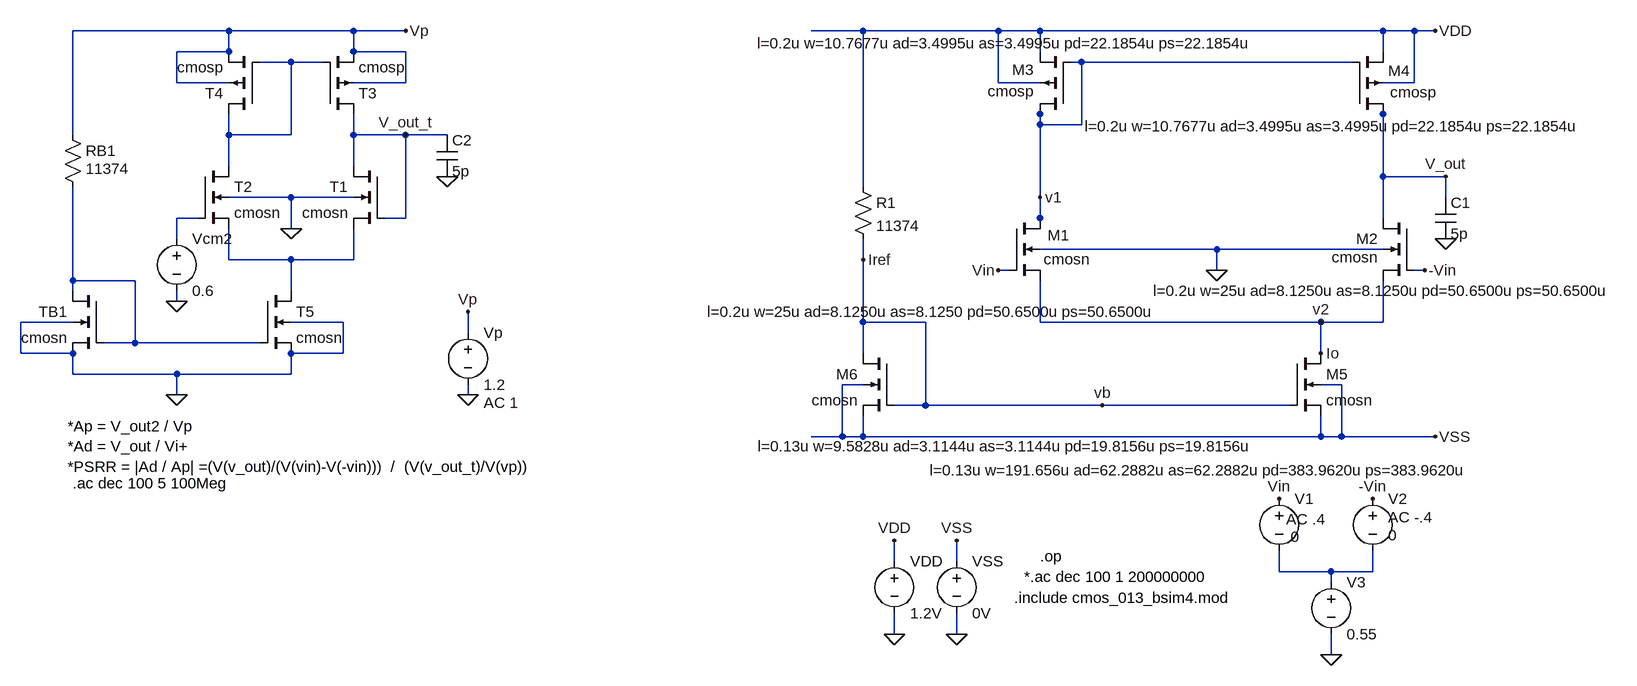
[diagram p0: schematic final_differential_pair.asc]
final_differential_pair.asc, the LTspice schematic file:
Version 4
SHEET 1 1616 948
WIRE -1072 -80 -1312 -80
WIRE -880 -80 -1072 -80
WIRE -800 -80 -880 -80
WIRE -96 -80 -176 -80
WIRE 112 -80 -96 -80
WIRE 176 -80 112 -80
WIRE 704 -80 176 -80
WIRE 752 -80 704 -80
WIRE 784 -80 752 -80
WIRE -1072 -48 -1072 -80
WIRE -1072 -48 -1152 -48
WIRE -880 -48 -880 -80
WIRE -800 -48 -880 -48
WIRE 176 -48 176 -80
WIRE 704 -48 704 -80
WIRE -976 -32 -1024 -32
WIRE -928 -32 -976 -32
WIRE 240 -32 224 -32
WIRE 656 -32 240 -32
WIRE -1152 0 -1152 -48
WIRE -1072 0 -1152 0
WIRE -800 0 -800 -48
WIRE -800 0 -880 0
WIRE 112 0 112 -80
WIRE 176 0 112 0
WIRE 752 0 752 -80
WIRE 752 0 704 0
WIRE 176 48 176 32
WIRE 704 48 704 32
WIRE 176 64 176 48
WIRE 240 64 240 -32
WIRE 240 64 176 64
WIRE -1312 80 -1312 -80
WIRE -1072 80 -1072 48
WIRE -976 80 -976 -32
WIRE -976 80 -1072 80
WIRE -880 80 -880 48
WIRE -800 80 -880 80
WIRE -736 80 -800 80
WIRE -1072 128 -1072 80
WIRE -880 128 -880 80
WIRE 704 144 704 48
WIRE 800 144 704 144
WIRE -96 160 -96 -80
WIRE -976 176 -1072 176
WIRE -880 176 -976 176
WIRE 176 176 176 64
WIRE 800 176 800 144
WIRE -1120 208 -1152 208
WIRE -800 208 -800 80
WIRE -800 208 -832 208
WIRE 176 208 176 176
WIRE 704 208 704 144
WIRE -976 224 -976 176
WIRE 176 224 176 208
WIRE -1152 240 -1152 208
WIRE 448 256 176 256
WIRE 704 256 448 256
WIRE -1072 272 -1072 224
WIRE -976 272 -1072 272
WIRE -880 272 -880 224
WIRE -880 272 -976 272
WIRE -96 272 -96 240
WIRE 128 288 112 288
WIRE 448 288 448 256
WIRE 768 288 752 288
WIRE -1312 304 -1312 160
WIRE -1216 304 -1312 304
WIRE -1312 320 -1312 304
WIRE -976 320 -976 272
WIRE -1152 336 -1152 320
WIRE -1312 368 -1392 368
WIRE -896 368 -976 368
WIRE -96 368 -96 272
WIRE 0 368 -96 368
WIRE 176 368 176 304
WIRE 608 368 176 368
WIRE 704 368 704 304
WIRE 704 368 608 368
WIRE -704 384 -704 352
WIRE -1216 400 -1216 304
WIRE -1216 400 -1264 400
WIRE -1024 400 -1216 400
WIRE -1392 416 -1392 368
WIRE -1312 416 -1392 416
WIRE -896 416 -896 368
WIRE -896 416 -976 416
WIRE -96 416 -96 368
WIRE 608 416 608 368
WIRE -1312 448 -1312 416
WIRE -1152 448 -1312 448
WIRE -976 448 -976 416
WIRE -976 448 -1152 448
WIRE -96 464 -128 464
WIRE 640 464 608 464
WIRE -1152 480 -1152 448
WIRE -704 480 -704 464
WIRE 0 496 0 368
WIRE 0 496 -48 496
WIRE 272 496 0 496
WIRE 560 496 272 496
WIRE -128 544 -128 464
WIRE -128 544 -176 544
WIRE -96 544 -96 512
WIRE -96 544 -128 544
WIRE 608 544 608 512
WIRE 608 544 -96 544
WIRE 640 544 640 464
WIRE 640 544 608 544
WIRE 784 544 640 544
WIRE -48 736 -48 704
WIRE 48 736 48 704
WIRE 544 752 544 720
WIRE 624 752 544 752
WIRE 688 752 688 720
WIRE 688 752 624 752
WIRE 624 768 624 752
WIRE -48 848 -48 816
WIRE 48 848 48 816
WIRE 624 880 624 848
FLAG 784 -80 VDD
FLAG -48 848 0
FLAG -48 704 VDD
FLAG 800 144 V_out
FLAG 784 544 VSS
FLAG 48 848 0
FLAG 48 704 VSS
FLAG 768 288 -Vin
FLAG 112 288 Vin
FLAG 544 640 Vin
FLAG 688 640 -Vin
FLAG 176 176 v1
FLAG 608 368 v2
FLAG 800 240 0
FLAG 272 496 vb
FLAG -96 272 Iref
FLAG 608 416 Io
FLAG 624 880 0
FLAG 448 288 0
FLAG -800 -80 Vp
FLAG -1152 480 0
FLAG -976 224 0
FLAG -800 80 V_out_t
FLAG -704 480 0
FLAG -1152 336 0
FLAG -736 144 0
FLAG -704 352 Vp
SYMBOL nmos4 752 208 M0
WINDOW 3 56 60 Left 2
WINDOW 123 -311 112 Left 2
SYMATTR Value cmosn
SYMATTR Value2 l=0.2u w=25u ad=8.1250u as=8.1250u pd=50.6500u ps=50.6500u
SYMATTR InstName M2
SYMBOL nmos4 128 208 R0
WINDOW 0 60 26 Left 2
WINDOW 3 54 63 Left 2
WINDOW 123 -464 144 Left 2
SYMATTR InstName M1
SYMATTR Value cmosn
SYMATTR Value2 l=0.2u w=25u ad=8.1250u as=8.1250 pd=50.6500u ps=50.6500u
SYMBOL pmos4 656 48 M180
WINDOW 123 -411 -19 Left 2
WINDOW 0 56 67 Left 2
WINDOW 3 59 34 Left 2
SYMATTR Value2 l=0.2u w=10.7677u ad=3.4995u as=3.4995u pd=22.1854u ps=22.1854u
SYMATTR InstName M4
SYMATTR Value cmosp
SYMBOL pmos4 224 48 R180
WINDOW 123 -290 109 Left 2
WINDOW 0 57 68 Left 2
WINDOW 3 57 35 Left 2
SYMATTR Value2 l=0.2u w=10.7677u ad=3.4995u as=3.4995u pd=22.1854u ps=22.1854u
SYMATTR InstName M3
SYMATTR Value cmosp
SYMBOL voltage -48 720 R0
SYMATTR InstName VDD
SYMATTR Value 1.2V
SYMBOL voltage 48 720 R0
SYMATTR InstName VSS
SYMATTR Value 0V
SYMBOL voltage 544 624 R0
WINDOW 123 11 47 Left 2
WINDOW 39 0 0 Left 0
WINDOW 3 18 74 Left 2
SYMATTR Value2 AC .4
SYMATTR Value 0
SYMATTR InstName V1
SYMBOL voltage 688 624 R0
WINDOW 123 24 44 Left 2
WINDOW 39 0 0 Left 0
WINDOW 3 24 72 Left 2
SYMATTR Value2 AC -.4
SYMATTR Value 0
SYMATTR InstName V2
SYMBOL cap 784 176 R0
SYMATTR InstName C1
SYMATTR Value 5p
SYMBOL nmos4 560 416 R0
WINDOW 123 -554 180 Left 2
SYMATTR Value2 l=0.13u w=191.656u ad=62.2882u as=62.2882u pd=383.9620u ps=383.9620u
SYMATTR InstName M5
SYMATTR Value cmosn
SYMBOL nmos4 -48 416 M0
WINDOW 123 -563 143 Left 2
SYMATTR Value2 l=0.13u w=9.5828u ad=3.1144u as=3.1144u pd=19.8156u ps=19.8156u
SYMATTR InstName M6
SYMATTR Value cmosn
SYMBOL res -112 144 R0
SYMATTR InstName R1
SYMATTR Value 11374
SYMBOL voltage 624 752 R0
SYMATTR InstName V3
SYMATTR Value 0.55
SYMBOL nmos4 -832 128 M0
SYMATTR InstName T1
SYMATTR Value cmosn
SYMATTR Value2 l=0.2u w=25u ad=8.1250u as=8.1250 pd=50.6500u ps=50.6500u
SYMBOL nmos4 -1120 128 R0
SYMATTR InstName T2
SYMATTR Value cmosn
SYMATTR Value2 l=0.2u w=25u ad=8.1250u as=8.1250 pd=50.6500u ps=50.6500u
SYMBOL pmos4 -928 48 M180
SYMATTR InstName T3
SYMATTR Value cmosp
SYMATTR Value2 l=0.2u w=10.7677u ad=3.4995u as=3.4995u pd=22.1854u ps=22.1854u
SYMBOL pmos4 -1024 48 R180
SYMATTR InstName T4
SYMATTR Value cmosp
SYMATTR Value2 l=0.2u w=10.7677u ad=3.4995u as=3.4995u pd=22.1854u ps=22.1854u
SYMBOL nmos4 -1024 320 R0
SYMATTR InstName T5
SYMATTR Value cmosn
SYMATTR Value2 l=0.13u w=191.656u ad=62.2882u as=62.2882u pd=383.9620u ps=383.9620u
SYMBOL nmos4 -1264 320 M0
SYMATTR InstName TB1
SYMATTR Value cmosn
SYMATTR Value2 l=0.13u w=9.5828u ad=3.1144u as=3.1144u pd=19.8156u ps=19.8156u
SYMBOL res -1328 64 R0
WINDOW 3 36 68 Left 2
SYMATTR Value 11374
SYMATTR InstName RB1
SYMBOL voltage -704 368 R0
WINDOW 123 24 124 Left 2
WINDOW 39 0 0 Left 0
SYMATTR InstName Vp
SYMATTR Value 1.2
SYMATTR Value2 AC 1
SYMBOL voltage -1152 224 R0
SYMATTR InstName Vcm2
SYMATTR Value 0.6
SYMBOL cap -752 80 R0
SYMATTR InstName C2
SYMATTR Value 5p
TEXT 152 760 Left 2 !*.ac dec 100 1 200000000
TEXT 136 792 Left 2 !.include cmos_013_bsim4.mod
TEXT 176 728 Left 2 !.op
TEXT -1320 528 Left 2 !*Ap = V_out2 / Vp\n*Ad = V_out / Vi+\n*PSRR = |Ad / Ap| =(V(v_out)/(V(vin)-V(-vin)))  /  (V(v_out_t)/V(vp))
TEXT -1312 616 Left 2 !.ac dec 100 5 100Meg

The netlist it stands for:
* final_differential_pair.asc
M2 V_out -Vin Io 0 cmosn l=0.2u w=25u ad=8.1250u as=8.1250u pd=50.6500u ps=50.6500u
M1 v1 Vin Io 0 cmosn l=0.2u w=25u ad=8.1250u as=8.1250 pd=50.6500u ps=50.6500u
M4 V_out v1 VDD VDD cmosp l=0.2u w=10.7677u ad=3.4995u as=3.4995u pd=22.1854u ps=22.1854u
M3 v1 v1 VDD VDD cmosp l=0.2u w=10.7677u ad=3.4995u as=3.4995u pd=22.1854u ps=22.1854u
VDD VDD 0 1.2V
VSS VSS 0 0V
V1 Vin N005 0 AC .4
V2 -Vin N005 0 AC -.4
C1 V_out 0 5p
M5 Io Iref VSS VSS cmosn l=0.13u w=191.656u ad=62.2882u as=62.2882u pd=383.9620u ps=383.9620u
M6 Iref Iref VSS VSS cmosn l=0.13u w=9.5828u ad=3.1144u as=3.1144u pd=19.8156u ps=19.8156u
R1 VDD Iref 11374
V3 N005 0 0.55
M§T1 V_out_t V_out_t N003 0 cmosn l=0.2u w=25u ad=8.1250u as=8.1250 pd=50.6500u ps=50.6500u
M§T2 N001 N002 N003 0 cmosn l=0.2u w=25u ad=8.1250u as=8.1250 pd=50.6500u ps=50.6500u
M§T3 V_out_t N001 Vp Vp cmosp l=0.2u w=10.7677u ad=3.4995u as=3.4995u pd=22.1854u ps=22.1854u
M§T4 N001 N001 Vp Vp cmosp l=0.2u w=10.7677u ad=3.4995u as=3.4995u pd=22.1854u ps=22.1854u
M§T5 N003 N004 0 0 cmosn l=0.13u w=191.656u ad=62.2882u as=62.2882u pd=383.9620u ps=383.9620u
M§TB1 N004 N004 0 0 cmosn l=0.13u w=9.5828u ad=3.1144u as=3.1144u pd=19.8156u ps=19.8156u
RB1 Vp N004 11374
Vp Vp 0 1.2 AC 1
Vcm2 N002 0 0.6
C2 V_out_t 0 5p
.model NMOS NMOS
.model PMOS PMOS
.lib standard.mos
*.ac dec 100 1 200000000
.include cmos_013_bsim4.mod
.op
*Ap = V_out2 / Vp
*Ad = V_out / Vi+
*PSRR = |Ad / Ap| =(V(v_out)/(V(vin)-V(-vin)))  /  (V(v_out_t)/V(vp))
.ac dec 100 5 100Meg
.backanno
.end